# EAGLE schematic IBL behavior control (EAGLE 6.5.0)
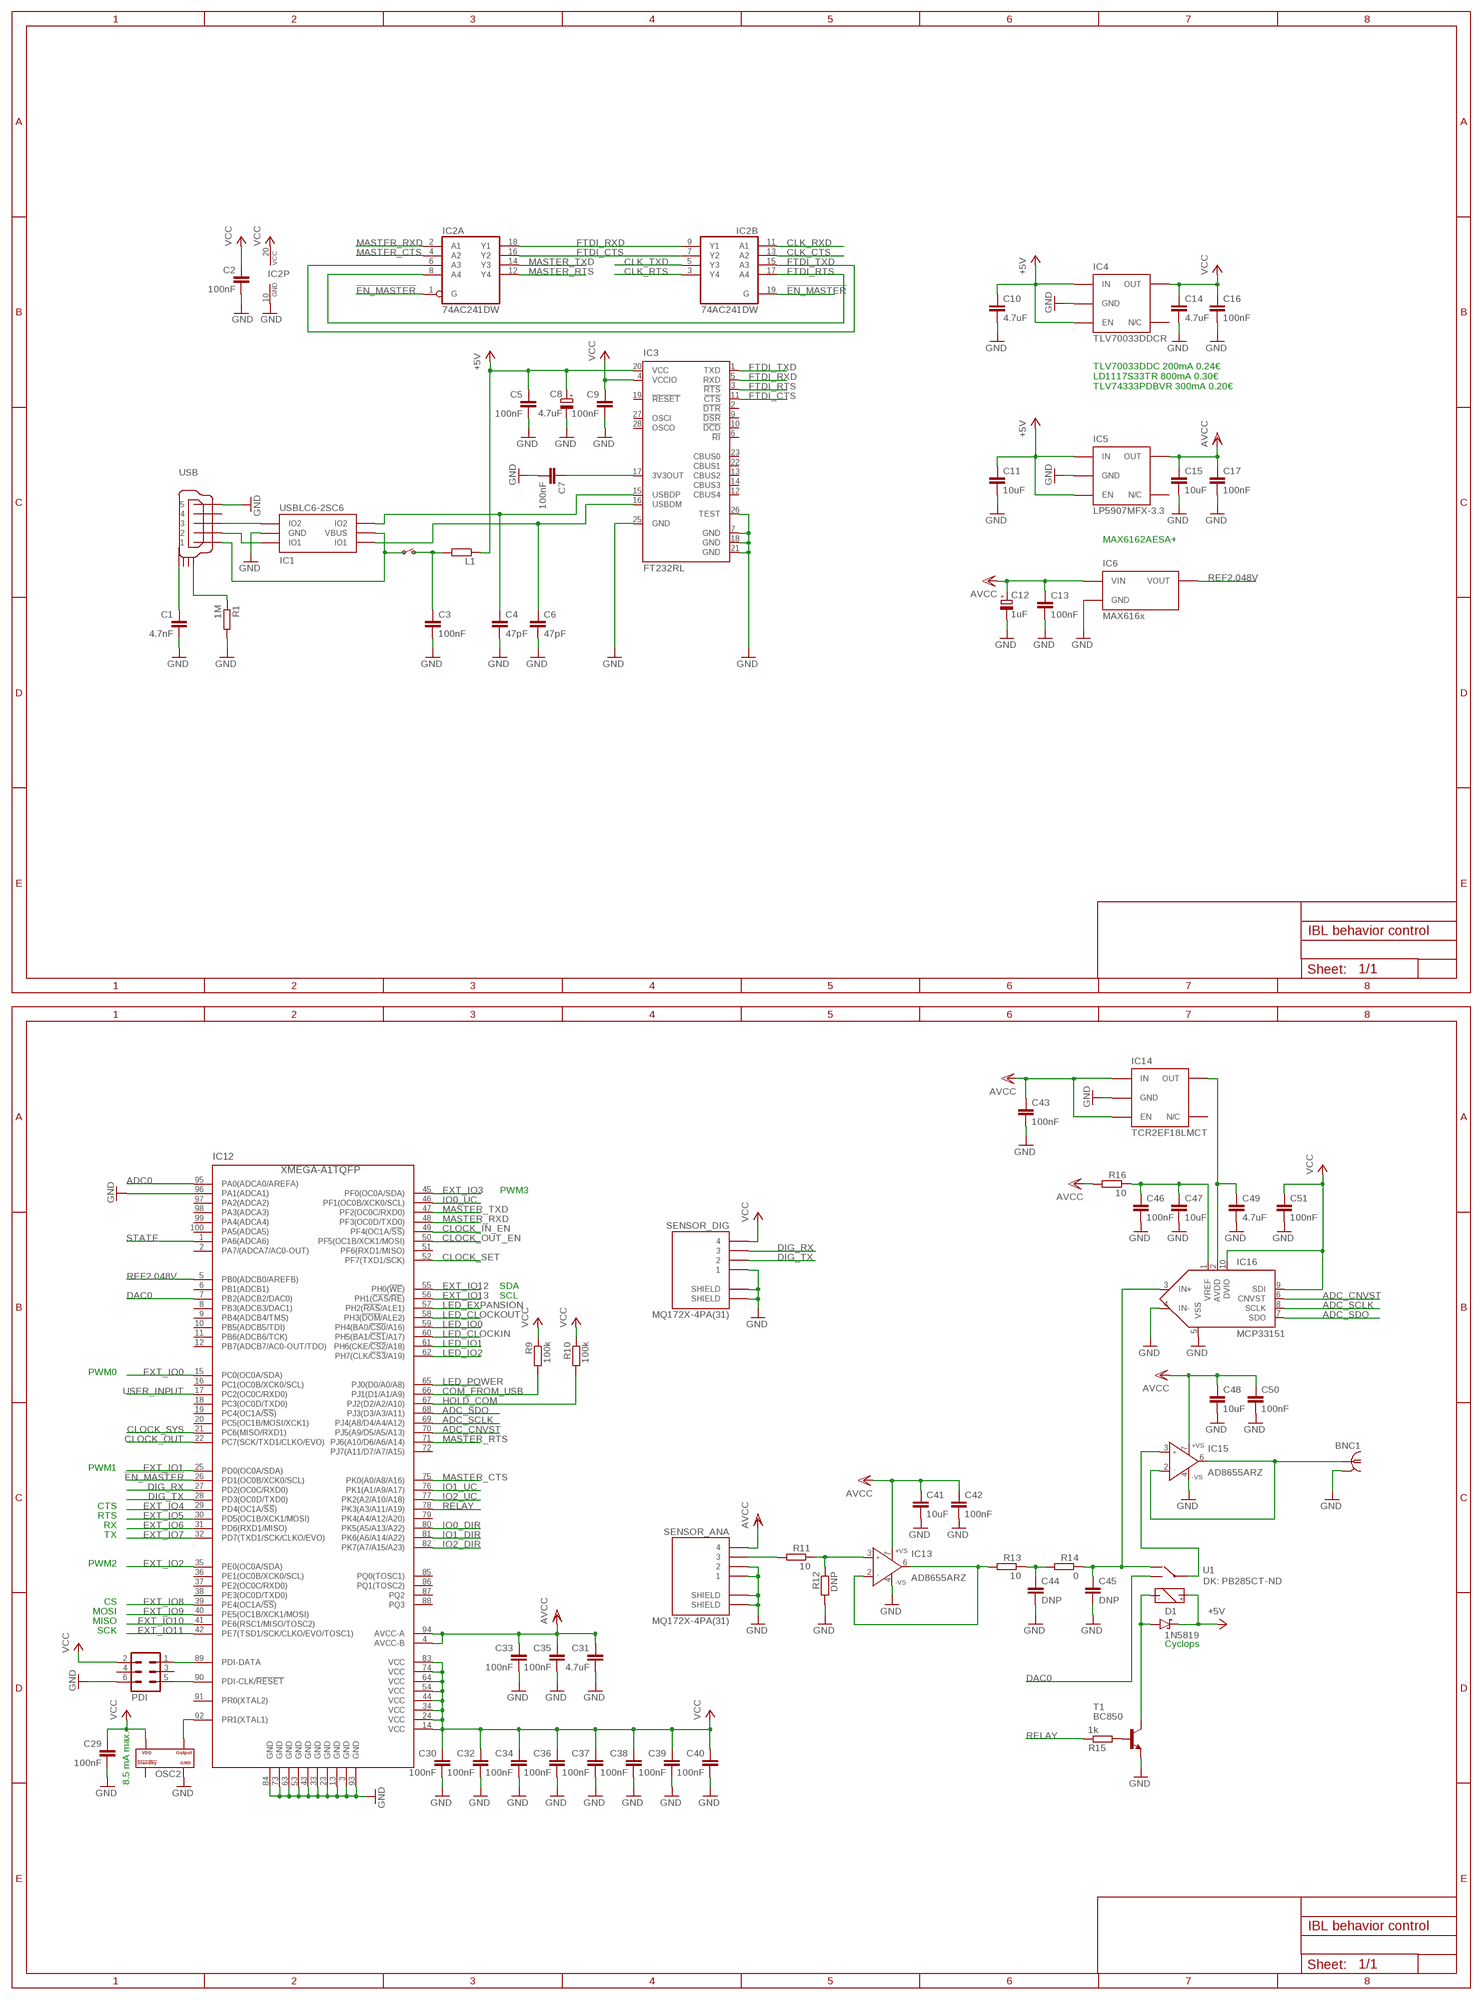
[diagram p0: schematic, sheet 1, part 1 of 2]
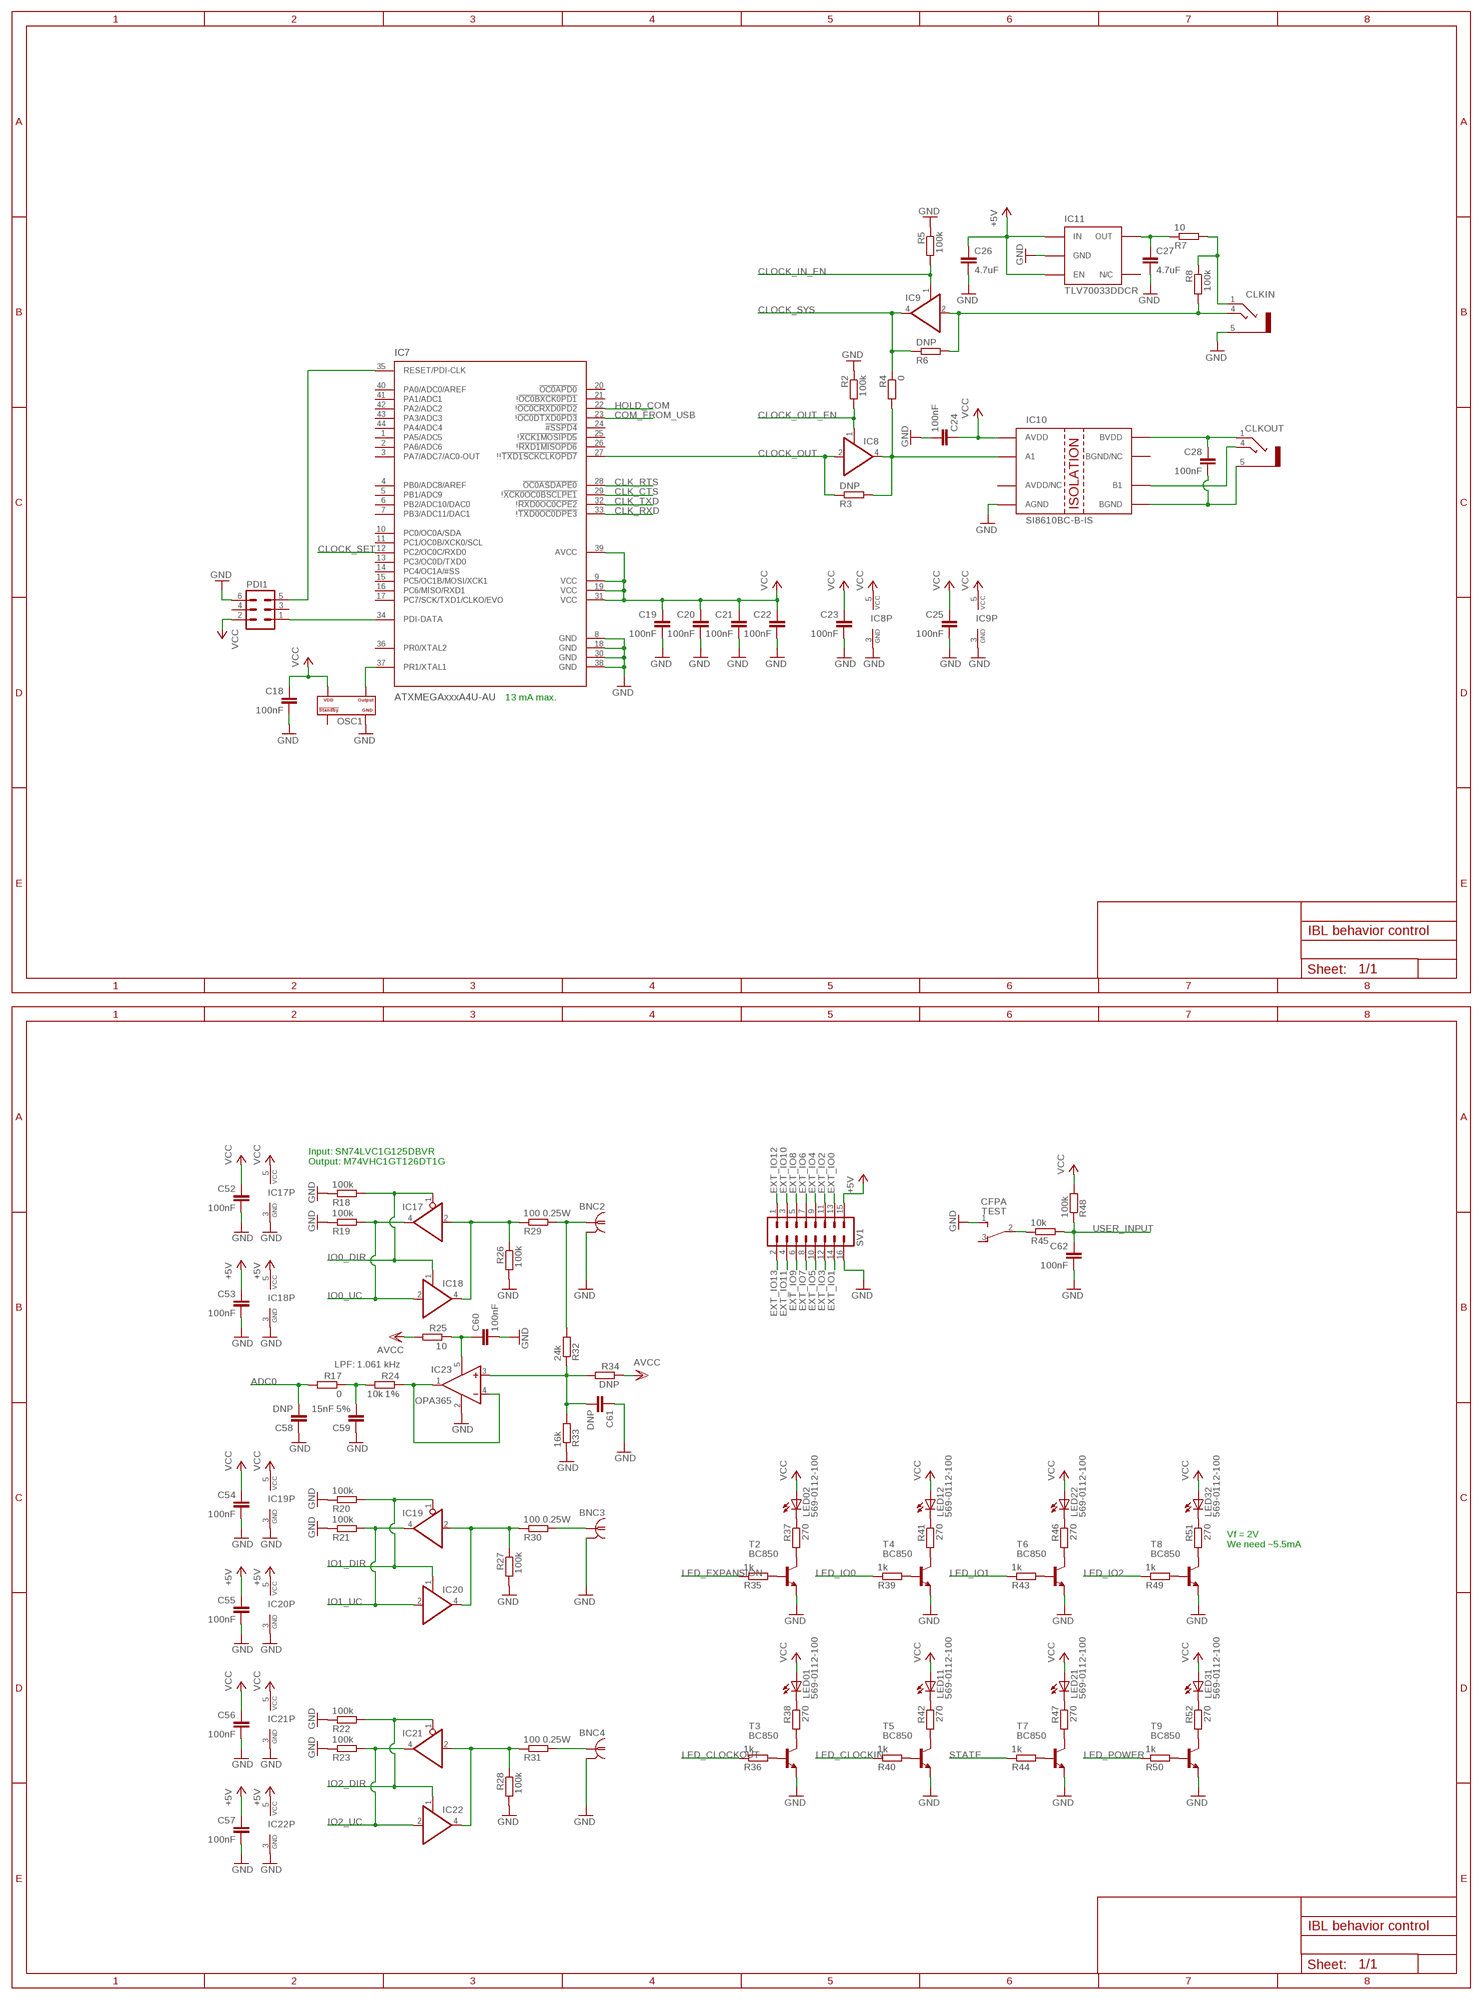
[diagram p1: schematic, sheet 1, part 2 of 2]

## Parts
BNC1  BNC_0731000105  [0731000105]
BNC2  BNC_0731000105  [0731000105]
BNC3  BNC_0731000105  [0731000105]
BNC4  BNC_0731000105  [0731000105]
C1  4.7nF  C-EUC0402  [C0402]
C2  100nF  C-EUC0402  [C0402]
C3  100nF  C-EUC0402  [C0402]
C4  47pF  C-EUC0402  [C0402]
C5  100nF  C-EUC0402  [C0402]
C6  47pF  C-EUC0402  [C0402]
C7  100nF  C-EUC0402  [C0402]
C8  4.7uF  CPOL-EUA/3216-18W  [A/3216-18W]
C9  100nF  C-EUC0402  [C0402]
C10  4.7uF  C-EUC0603  [C0603]
C11  10uF  C-EUC0603  [C0603]
C12  1uF  CPOL-EUR/2012-12R  [R/2012-12R]
C13  100nF  C-EUC0402  [C0402]
C14  4.7uF  C-EUC0603  [C0603]
C15  10uF  C-EUC0603  [C0603]
C16  100nF  C-EUC0402  [C0402]
C17  100nF  C-EUC0402  [C0402]
C18  100nF  C-EUC0402  [C0402]
C19  100nF  C-EUC0402  [C0402]
C20  100nF  C-EUC0402  [C0402]
C21  100nF  C-EUC0402  [C0402]
C22  100nF  C-EUC0402  [C0402]
C23  100nF  C-EUC0402  [C0402]
C24  100nF  C-EUC0402  [C0402]
C25  100nF  C-EUC0402  [C0402]
C26  4.7uF  C-EUC0603  [C0603]
C27  4.7uF  C-EUC0603  [C0603]
C28  100nF  C-EUC0402  [C0402]
C29  100nF  C-EUC0402  [C0402]
C30  100nF  C-EUC0402  [C0402]
C31  4.7uF  C-EUC0603  [C0603]
C32  100nF  C-EUC0402  [C0402]
C33  100nF  C-EUC0402  [C0402]
C34  100nF  C-EUC0402  [C0402]
C35  100nF  C-EUC0402  [C0402]
C36  100nF  C-EUC0402  [C0402]
C37  100nF  C-EUC0402  [C0402]
C38  100nF  C-EUC0402  [C0402]
C39  100nF  C-EUC0402  [C0402]
C40  100nF  C-EUC0402  [C0402]
C41  10uF  C-EUC0603  [C0603]
C42  100nF  C-EUC0402  [C0402]
C43  100nF  C-EUC0402  [C0402]
C44  DNP  C-EUC0402  [C0402]
C45  DNP  C-EUC0402  [C0402]
C46  100nF  C-EUC0402  [C0402]
C47  10uF  C-EUC0603  [C0603]
C48  10uF  C-EUC0603  [C0603]
C49  4.7uF  C-EUC0603  [C0603]
C50  100nF  C-EUC0402  [C0402]
C51  100nF  C-EUC0402  [C0402]
C52  100nF  C-EUC0402  [C0402]
C53  100nF  C-EUC0402  [C0402]
C54  100nF  C-EUC0402  [C0402]
C55  100nF  C-EUC0402  [C0402]
C56  100nF  C-EUC0402  [C0402]
C57  100nF  C-EUC0402  [C0402]
C58  DNP  C-EUC0402  [C0402]
C59  15nF 5%  C-EUC0402  [C0402]
C60  100nF  C-EUC0402  [C0402]
C61  DNP  C-EUC0402  [C0402]
C62  100nF  C-EUC0402  [C0402]
CLKIN  STEREO_JACK  [35RASMT2BHNTRX]
CLKOUT  STEREO_JACK  [35RASMT2BHNTRX]
D1  1N5819  S-DIODESOD-123  [SOD123]
IC1  USBLC6-2SC6  USBLC6-2  [SOT23-6L]
IC2  74AC241DW  [SO20W]
IC3  FT232RL  [SSOP28]
IC4  TLV70033DDCR  TLV700XX  [TSOT23-5]
IC5  LP5907MFX-3.3  TLV700XX  [TSOT23-5]
IC6  MAX616x  ADR45XX  [SO-08]
IC7  ATXMEGAxxxA4U-AU  AT-XMEGA-XXA4-AU  [QFP80P1200X1200X120-44N]
IC8  74AHC1G126DCK  [SC70-5]
IC9  74AHC1G126DCK  [SC70-5]
IC10  SI8610BC-B-IS  SI8610  [SO-08]
IC11  TLV70033DDCR  TLV700XX  [TSOT23-5]
IC12  XMEGA-A1TQFP  [TQFP100]
IC13  AD8655ARZ  AD8655R  [SO8]
IC14  TCR2EF18LMCT  TLV700XX  [TSOT23-5]
IC15  AD8655ARZ  AD8655R  [SO8]
IC16  MCP33151  [MSOP10]
IC17  74AHC1G125DBV  [SOT23-5]
IC18  74AHC1G126DCK  [SC70-5]
IC19  74AHC1G125DBV  [SOT23-5]
IC20  74AHC1G126DCK  [SC70-5]
IC21  74AHC1G125DBV  [SOT23-5]
IC22  74AHC1G126DCK  [SC70-5]
IC23  OPA365  [SOT23-5]
L1  ???  R-EU_R0805  [R0805]
LED0  569-0112-100  LED_2X_VERTICAL  [569-011X-X00_LED_ARRAY]
LED1  569-0112-100  LED_2X_VERTICAL  [569-011X-X00_LED_ARRAY]
LED2  569-0112-100  LED_2X_VERTICAL  [569-011X-X00_LED_ARRAY]
LED3  569-0112-100  LED_2X_VERTICAL  [569-011X-X00_LED_ARRAY]
OSC1  OSCILLATOR  [OSCILLATOR_3.2X2.5]
OSC2  OSCILLATOR  [OSCILLATOR_3.2X2.5]
PDI  MA03-2  [MA03-2]
PDI1  MA03-2  [MA03-2]
R1  1M  R-EU_R0402  [R0402]
R2  100k  R-EU_R0402  [R0402]
R3  DNP  R-EU_R0402  [R0402]
R4  0  R-EU_R0402  [R0402]
R5  100k  R-EU_R0402  [R0402]
R6  DNP  R-EU_R0402  [R0402]
R7  10  R-EU_R0402  [R0402]
R8  100k  R-EU_R0402  [R0402]
R9  100k  R-EU_R0402  [R0402]
R10  100k  R-EU_R0402  [R0402]
R11  10  R-EU_R0402  [R0402]
R12  DNP  R-EU_R0402  [R0402]
R13  10  R-EU_R0402  [R0402]
R14  0  R-EU_R0402  [R0402]
R15  1k  R-EU_R0402  [R0402]
R16  10  R-EU_R0402  [R0402]
R17  0  R-EU_R0402  [R0402]
R18  100k  R-EU_R0402  [R0402]
R19  100k  R-EU_R0402  [R0402]
R20  100k  R-EU_R0402  [R0402]
R21  100k  R-EU_R0402  [R0402]
R22  100k  R-EU_R0402  [R0402]
R23  100k  R-EU_R0402  [R0402]
R24  10k 1%  R-EU_R0402  [R0402]
R25  10  R-EU_R0402  [R0402]
R26  100k  R-EU_R0402  [R0402]
R27  100k  R-EU_R0402  [R0402]
R28  100k  R-EU_R0402  [R0402]
R29  100 0.25W  R-EU_R0603  [R0603]
R30  100 0.25W  R-EU_R0603  [R0603]
R31  100 0.25W  R-EU_R0603  [R0603]
R32  24k  R-EU_R0402  [R0402]
R33  16k  R-EU_R0402  [R0402]
R34  DNP  R-EU_R0402  [R0402]
R35  1k  R-EU_R0402  [R0402]
R36  1k  R-EU_R0402  [R0402]
R37  270  R-EU_R0402  [R0402]
R38  270  R-EU_R0402  [R0402]
R39  1k  R-EU_R0402  [R0402]
R40  1k  R-EU_R0402  [R0402]
R41  270  R-EU_R0402  [R0402]
R42  270  R-EU_R0402  [R0402]
R43  1k  R-EU_R0402  [R0402]
R44  1k  R-EU_R0402  [R0402]
R45  10k  R-EU_R0402  [R0402]
R46  270  R-EU_R0402  [R0402]
R47  270  R-EU_R0402  [R0402]
R48  100k  R-EU_R0402  [R0402]
R49  1k  R-EU_R0402  [R0402]
R50  1k  R-EU_R0402  [R0402]
R51  270  R-EU_R0402  [R0402]
R52  270  R-EU_R0402  [R0402]
SENSOR_ANA  MQ172X-4PA(31)  [MQ172X-4PA(31)]
SENSOR_DIG  MQ172X-4PA(31)  [MQ172X-4PA(31)]
SV1  ML16L  [ML16L]
T1  BC850  [SOT23]
T2  BC850  [SOT23]
T3  BC850  [SOT23]
T4  BC850  [SOT23]
T5  BC850  [SOT23]
T6  BC850  [SOT23]
T7  BC850  [SOT23]
T8  BC850  [SOT23]
T9  BC850  [SOT23]
TEST  CFPA  SPDT_CFPA  [CFPA]
U1  DK: PB285CT-ND  RELAY  [RELAY]
USB  USB_MINI_B  [240-0002-1]

## Nets
5VSWITCH: C3.1 L1.2
5VUSB: IC1.P$5(VBUS) USB.P$1
!EN_MASTER: IC2.1(A:G) IC2.19(B:G) IC12.26(PD1(OC0B/XCK0/SCL))
+5V: C5.1 C8.+ C10.1 C11.1 C26.1 C53.1 C55.1 C57.1 D1.C IC3.20(VCC) IC4.1(IN) IC4.3(EN) IC5.1(IN) IC5.3(EN) IC11.1(IN) IC11.3(EN) IC18.5(VCC) IC20.5(VCC) IC22.5(VCC) L1.1 SV1.15 U1.3(R+)
ADC0: C58.2 IC12.95(PA0(ADCA0/AREFA)) R17.2
ADC_CNVST: IC12.70(PJ5(A9/D5/A5/A13)) IC16.6(CNVST)
ADC_SCLK: IC12.69(PJ4(A8/D4/A4/A12)) IC16.8(SCLK)
ADC_SDO: IC12.68(PJ3(D3/A3/A11)) IC16.7(SDO)
CLK_CTS: IC2.13(B:A2) IC7.29(!!XCK0OC0BSCLPE1)
CLK_RTS: IC2.3(B:Y4) IC7.28(!OC0ASDAPE0)
CLK_RXD: IC2.11(B:A1) IC7.33(!!TXD0OC0DPE3)
CLK_TXD: IC2.5(B:Y3) IC7.32(!!RXD0OC0CPE2)
CLOCK_IN_EN: IC9.1(OE) IC12.49(PF4(OC1A/!SS!)) R5.2
CLOCK_OUT: IC7.27(!!!TXD1SCKCLKOPD7) IC8.2(I) IC12.22(PC7(SCK/TXD1/CLKO/EVO)) R3.1
CLOCK_OUT_EN: IC8.1(OE) IC12.50(PF5(OC1B/XCK1/MOSI)) R2.2
CLOCK_SET: IC7.12(PC2/OC0C/RXD0) IC12.52(PF7(TXD1/SCK))
CLOCK_SYS: IC9.4(O) IC12.21(PC6(MISO/RXD1)) R4.1 R6.1
COM_FROM_USB: IC7.23(!!OC0DTXD0PD3) IC12.66(PJ1(D1/A1/A9)) R9.2
DAC0: IC12.7(PB2(ADCB2/DAC0)) U1.10(NO)
DIG_RX: IC12.27(PD2(OC0C/RXD0)) SENSOR_DIG.3
DIG_TX: IC12.28(PD3(OC0D/TXD0)) SENSOR_DIG.2
EXT_IO0: IC12.15(PC0(OC0A/SDA)) SV1.13
EXT_IO1: IC12.25(PD0(OC0A/SDA)) SV1.14
EXT_IO2: IC12.35(PE0(OC0A/SDA)) SV1.11
EXT_IO3: IC12.45(PF0(OC0A/SDA)) SV1.12
EXT_IO4: IC12.29(PD4(OC1A/!SS!)) SV1.9
EXT_IO5: IC12.30(PD5(OC1B/XCK1/MOSI)) SV1.10
EXT_IO6: IC12.31(PD6(RXD1/MISO)) SV1.7
EXT_IO7: IC12.32(PD7(TXD1/SCK/CLKO/EVO)) SV1.8
EXT_IO8: IC12.39(PE4(OC1A/!SS!)) SV1.5
EXT_IO9: IC12.40(PE5(OC1B/XCK1/MOSI)) SV1.6
EXT_IO10: IC12.41(PE6(RSC1/MISO/TOSC2)) SV1.3
EXT_IO11: IC12.42(PE7(TSD1/SCK/CLKO/EVO/TOSC1)) SV1.4
EXT_IO12: IC12.55(PH0(!WE!)) SV1.1
EXT_IO13: IC12.56(PH1(!CAS!/!RE!)) SV1.2
FTDI_CTS: IC2.7(B:Y2) IC2.16(A:Y2) IC3.11(!CTS)
FTDI_RTS: IC2.8(A:A4) IC2.17(B:A4) IC3.3(!RTS)
FTDI_RXD: IC2.9(B:Y1) IC2.18(A:Y1) IC3.5(RXD)
FTDI_TXD: IC2.6(A:A3) IC2.15(B:A3) IC3.1(TXD)
GND: BNC1.2 BNC1.3 BNC2.2 BNC2.3 BNC3.2 BNC3.3 BNC4.2 BNC4.3 C1.2 C2.2 C3.2 C4.2 C5.2 C6.2 C7.2 C8.- C9.2 C10.2 C11.2 C12.- C13.2 C14.2 C15.2 C16.2 C17.2 C18.2 C19.2 C20.2 C21.2 C22.2 C23.2 C24.2 C25.2 C26.2 C27.2 C29.2 C30.2 C31.2 C32.2 C33.2 C34.2 C35.2 C36.2 C37.2 C38.2 C39.2 C40.2 C41.2 C42.2 C43.2 C44.2 C45.2 C46.2 C47.2 C48.2 C49.2 C50.2 C51.2 C52.2 C53.2 C54.2 C55.2 C56.2 C57.2 C58.1 C59.1 C60.2 C61.1 C62.2 CLKIN.5 IC1.P$2(GND) IC2.10(P:GND) IC3.7(GND) IC3.18(GND) IC3.21(GND) IC3.25(GND) IC3.26(TEST) IC4.2(GND) IC5.2(GND) IC6.4(GND) IC7.8(GND) IC7.18(GND) IC7.30(GND) IC7.38(GND) IC8.3(GND) IC9.3(GND) IC10.4(AGND) IC11.2(GND) IC12.3(GND) IC12.13(GND) IC12.23(GND) IC12.33(GND) IC12.43(GND) IC12.53(GND) IC12.63(GND) IC12.73(GND) IC12.84(GND) IC12.93(GND) IC12.96(PA1(ADCA1)) IC13.4(-VS) IC14.2(GND) IC15.4(-VS) IC16.4(IN-) IC16.5(VSS) IC17.3(GND) IC18.3(GND) IC19.3(GND) IC20.3(GND) IC21.3(GND) IC22.3(GND) IC23.2(V-) OSC1.P$2(GND) OSC2.P$2(GND) PDI1.6 PDI.6 R1.2 R2.1 R5.1 R12.2 R18.1 R19.1 R20.1 R21.1 R22.1 R23.1 R26.2 R27.2 R28.2 R33.1 SENSOR_ANA.1 SENSOR_ANA.2 SENSOR_ANA.SHIELD1(SHIELD) SENSOR_ANA.SHIELD2(SHIELD) SENSOR_DIG.1 SENSOR_DIG.SHIELD1(SHIELD) SENSOR_DIG.SHIELD2(SHIELD) SV1.16 T1.2(E) T2.2(E) T3.2(E) T4.2(E) T5.2(E) T6.2(E) T7.2(E) T8.2(E) T9.2(E) TEST.1 USB.P$5
GND_ISO: C28.2 CLKOUT.5 IC10.5(BGND)
HOLD_COM: IC7.22(!!OC0CRXD0PD2) IC12.67(PJ2(D2/A2/A10)) R10.2
IO0_ANALOG: C59.2 R17.1 R24.2
IO0_DIR: IC12.80(PK5(A5/A13/A22)) IC17.1(OE) IC18.1(OE) R18.2
IO0_UC: IC12.46(PF1(OC0B/XCK0/SCL)) IC17.4(O) IC18.2(I) R19.2
IO1_DIR: IC12.81(PK6(A6/A14/A22)) IC19.1(OE) IC20.1(OE) R20.2
IO1_UC: IC12.76(PK1(A1/A9/A17)) IC19.4(O) IC20.2(I) R21.2
IO2_DIR: IC12.82(PK7(A7/A15/A23)) IC21.1(OE) IC22.1(OE) R22.2
IO2_UC: IC12.77(PK2(A2/A10/A18)) IC21.4(O) IC22.2(I) R23.2
LED_CLOCKIN: IC12.60(PH5(BA1/!CS1!/A17)) R40.1
LED_CLOCKOUT: IC12.58(PH3(!DOM!/ALE2)) R36.1
LED_EXPANSION: IC12.57(PH2(!RAS!/ALE1)) R35.1
LED_IO0: IC12.59(PH4(BA0/!CS0!/A16)) R39.1
LED_IO1: IC12.61(PH6(CKE/!CS2!/A18)) R43.1
LED_IO2: IC12.62(PH7(CLK/!CS3!/A19)) R49.1
LED_POWER: IC12.65(PJ0(D0/A0/A8)) R50.1
MASTER_CTS: IC2.4(A:A2) IC12.75(PK0(A0/A8/A16))
MASTER_RTS: IC2.12(A:Y4) IC12.71(PJ6(A10/D6/A6/A14))
MASTER_RXD: IC2.2(A:A1) IC12.48(PF3(OC0D/TXD0))
MASTER_TXD: IC2.14(A:Y3) IC12.47(PF2(OC0C/RXD0))
N$2: CLKOUT.4 IC10.6(B1)
N$3: R35.2 T2.1(B)
N$4: LED0.C2(2:C) R37.1
N$5: C28.1 CLKOUT.1 IC10.8(BVDD)
N$6: IC17.2(I) IC18.4(O) R26.1 R29.1
N$8: R37.2 T2.3(C)
N$9: BNC2.1 R29.2 R32.2
N$10: IC19.2(I) IC20.4(O) R27.1 R30.1
N$11: BNC3.1 R30.2
N$12: IC21.2(I) IC22.4(O) R28.1 R31.1
N$13: BNC4.1 R31.2
N$14: R36.2 T3.1(B)
N$15: R43.2 T6.1(B)
N$16: R38.2 T3.3(C)
N$17: R39.2 T4.1(B)
N$18: LED3.C1(1:C) R52.1
N$19: R41.2 T4.3(C)
N$20: R40.2 T5.1(B)
N$21: R46.2 T6.3(C)
N$22: R42.2 T5.3(C)
N$23: LED3.C2(2:C) R51.1
N$24: R44.2 T7.1(B)
N$25: R47.2 T7.3(C)
N$26: R49.2 T8.1(B)
N$27: R51.2 T8.3(C)
N$28: R50.2 T9.1(B)
N$29: R52.2 T9.3(C)
N$30: LED1.C2(2:C) R41.1
N$31: LED2.C2(2:C) R46.1
N$32: LED1.C1(1:C) R42.1
N$33: LED2.C1(1:C) R47.1
N$34: R45.1 TEST.2
N$35: C60.1 IC23.5(V+) R25.1
N$36: LED0.C1(1:C) R38.1
N$37: IC13.2(IN-) IC13.6(OUT) R13.2
N$38: C7.1 IC3.17(3V3OUT)
N$39: IC13.3(IN+) R11.1 R12.1
N$40: IC1.P$1(IO1) USB.P$2
N$41: CLKIN.1 R7.2 R8.1
N$42: C27.1 IC11.5(OUT) R7.1
N$43: IC8.4(O) IC10.2(A1) R3.2 R4.2
N$44: C49.1 IC14.5(OUT) IC16.2(AVDD)
N$45: C44.1 R13.1 R14.2
N$46: C45.1 IC16.3(IN+) R14.1 U1.1(NC)
N$48: BNC1.1 IC15.2(IN-) IC15.6(OUT)
N$49: C46.1 C47.1 IC16.1(VREF) R16.1
N$50: IC1.P$3(IO2) USB.P$3
N$51: IC15.3(IN+) U1.5(IN)
N$52: R11.2 SENSOR_ANA.3
N$55: R15.2 T1.1(B)
N$57: D1.A T1.3(C) U1.8(R-)
N$58: IC23.1(OUT) IC23.4(-IN) R24.1
N$59: C1.1 USB.SHIELD_4
N$61: R1.1 USB.SHIELD_1
N$64: C61.2 IC23.3(+IN) R32.1 R33.2 R34.2
OSC1: IC12.92(PR1(XTAL1)) OSC2.P$3(OUTPUT)
OSC2: IC7.37(PR1/XTAL1) OSC1.P$3(OUTPUT)
PDI-CLK: IC7.35(RESET/PDI-CLK) PDI1.5
PDI-DATA: IC7.34(PDI-DATA) PDI1.1
PDI_CLK: IC12.90(PDI-CLK/!RESET) PDI.5
PDI_DATA: IC12.89(PDI-DATA) PDI.1
REF2.048V: IC6.6(VOUT) IC12.5(PB0(ADCB0/AREFB))
RELAY: IC12.78(PK3(A3/A11/A19)) R15.1
STATE: IC12.1(PA6(ADCA6)) R44.1
SYNCIN: CLKIN.4 IC9.2(I) R6.2 R8.2
USBDM: C6.1 IC1.P$6(IO1) IC3.16(USBDM)
USBDP: C4.1 IC1.P$4(IO2) IC3.15(USBDP)
USER_INPUT: C62.1 IC12.17(PC2(OC0C/RXD0)) R45.2 R48.1
VCC: C2.1 C9.1 C14.1 C16.1 C18.1 C19.1 C20.1 C21.1 C22.1 C23.1 C24.1 C25.1 C29.1 C30.1 C32.1 C34.1 C36.1 C37.1 C38.1 C39.1 C40.1 C51.1 C52.1 C54.1 C56.1 IC2.20(P:VCC) IC3.4(VCCIO) IC4.5(OUT) IC7.9(VCC) IC7.19(VCC) IC7.31(VCC) IC7.39(AVCC) IC8.5(VCC) IC9.5(VCC) IC10.1(AVDD) IC12.14(VCC) IC12.24(VCC) IC12.34(VCC) IC12.44(VCC) IC12.54(VCC) IC12.64(VCC) IC12.74(VCC) IC12.83(VCC) IC16.9(SDI) IC16.10(DVIO) IC17.5(VCC) IC19.5(VCC) IC21.5(VCC) LED0.A1(1:A) LED0.A2(2:A) LED1.A1(1:A) LED1.A2(2:A) LED2.A1(1:A) LED2.A2(2:A) LED3.A1(1:A) LED3.A2(2:A) OSC1.P$4(VDD) OSC2.P$4(VDD) PDI1.2 PDI.2 R9.1 R10.1 R48.2 SENSOR_DIG.4
VDD: C12.+ C13.1 C15.1 C17.1 C31.1 C33.1 C35.1 C41.1 C42.1 C43.1 C48.1 C50.1 IC5.5(OUT) IC6.2(VIN) IC12.4(AVCC-B) IC12.94(AVCC-A) IC13.7(+VS) IC14.1(IN) IC14.3(EN) IC15.7(+VS) R16.2 R25.2 R34.1 SENSOR_ANA.4 ; supply symbol labelled AVCC
Unconnected: IC3.2(!DTR) IC3.6(!RI) IC3.9(!DSR) IC3.10(!DCD) IC3.12(CBUS4) IC3.13(CBUS2) IC3.14(CBUS3) IC3.19(!RESET) IC3.22(CBUS1) IC3.23(CBUS0) IC3.27(OSCI) IC3.28(OSCO) IC4.4(N/C) IC5.4(N/C) IC7.1(PA5/ADC5) IC7.2(PA6/ADC6) IC7.3(PA7/ADC7/AC0-OUT) IC7.4(PB0/ADC8/AREF) IC7.5(PB1/ADC9) IC7.6(PB2/ADC10/DAC0) IC7.7(PB3/ADC11/DAC1) IC7.10(PC0/OC0A/SDA) IC7.11(PC1/OC0B/XCK0/SCL) IC7.13(PC3/OC0D/TXD0) IC7.14(PC4/OC1A/#SS) IC7.15(PC5/OC1B/MOSI/XCK1) IC7.16(PC6/MISO/RXD1) IC7.17(PC7/SCK/TXD1/CLKO/EVO) IC7.20(!OC0APD0) IC7.21(!!OC0BXCK0PD1) IC7.24(!#SSPD4) IC7.25(!!XCK1MOSIPD5) IC7.26(!!RXD1MISOPD6) IC7.36(PR0/XTAL2) IC7.40(PA0/ADC0/AREF) IC7.41(PA1/ADC1) IC7.42(PA2/ADC2) IC7.43(PA3/ADC3) IC7.44(PA4/ADC4) IC10.3(AVDD/NC) IC10.7(BGND/NC) IC11.4(N/C) IC12.2(PA7/(ADCA7/AC0-OUT)) IC12.6(PB1(ADCB1)) IC12.8(PB3(ADCB3/DAC1)) IC12.9(PB4(ADCB4/TMS)) IC12.10(PB5(ADCB5/TDI)) IC12.11(PB6(ADCB6/TCK)) IC12.12(PB7(ADCB7/AC0-OUT/TDO)) IC12.16(PC1(OC0B/XCK0/SCL)) IC12.18(PC3(OC0D/TXD0)) IC12.19(PC4(OC1A/!SS!)) IC12.20(PC5(OC1B/MOSI/XCK1)) IC12.36(PE1(OC0B/XCK0/SCL)) IC12.37(PE2(OC0C/RXD0)) IC12.38(PE3(OC0D/TXD0)) IC12.51(PF6(RXD1/MISO)) IC12.72(PJ7(A11/D7/A7/A15)) IC12.79(PK4(A4/A12/A20)) IC12.85(PQ0(TOSC1)) IC12.86(PQ1(TOSC2)) IC12.87(PQ2) IC12.88(PQ3) IC12.91(PR0(XTAL2)) IC12.97(PA2(ADCA2)) IC12.98(PA3(ADCA3)) IC12.99(PA4(ADCA4)) IC12.100(PA5(ADCA5)) IC14.4(N/C) OSC1.P$1(STANDBY#) OSC2.P$1(STANDBY#) PDI1.3 PDI1.4 PDI.3 PDI.4 TEST.3 USB.P$4 USB.SHIELD_2 USB.SHIELD_3

## Notes on the sheet
- TLV70033DDC 200mA 0.24€
  LD1117S33TR 800mA 0.30€
  TLV74333PDBVR 300mA 0.20€
- MAX6162AESA+
- 13 mA max.
- Input: SN74LVC1G125DBVR
  Output: M74VHC1GT126DT1G
- PWM3
- SDA
- SCL
- LPF: 1.061 kHz
- PWM0
- PWM1
- CTS
- RTS
- RX
- TX
- Vf = 2V
  We need ~5.5mA
- PWM2
- CS
- MOSI
- MISO
- SCK
- Cyclops
- 8.5 mA max.

## Library data of the parts
BNC1-BNC4 = jonnew:BNC: BNC CONNECTOR M/A COM www.macom.com distributor Farnell 149-452
C1-C7 C9-C11 C13-C62 = rcl:C-EU: CAPACITOR, European symbol
C8 C12 = rcl:CPOL-EU: POLARIZED CAPACITOR, European symbol
CLKIN CLKOUT = CNP-connectors:STEREO_JACK
D1 = jonnew:S-DIODE: Schottky Diode
IC1 = CNP 2:USBLC6-2
IC2 = 74xx-eu:74*241: Octal BUFFER and LINE DRIVER, 3-state
IC3 = ftdichip:FT232R: Source: http://www.ftdichip.com/Documents/DataSheets/DS_FT232R_v104.pdf; MPN: FT232RL; OC_FARNELL: 1146032; OC_NEWARK: 91K9918
IC4 IC5 IC11 IC14 = CNP:TLV700XX
IC6 = CNP-ics 2:ADR45XX
IC7 = xmega-a4:AT-XMEGA-XXA4-AU: ATxMega a4 Serie
IC8 IC9 IC18 IC20 IC22 = 74xx-little-de:74*1G126: Single Bus Buffer Gate With 3-State Outputs
IC10 = CNP-ics 2:SI8610
IC12 = avr-7:XMEGA-A1: Atmel XMega A1 Series processor
IC13 IC15 = analog-devices:AD8655: Low Noise, Precision CMOS Amplifier Source: http://www.analog.com/static/imported-files/data_sheets/AD8655_8656.pdf; MF: ALTERA CORPORATION; MPN: AD8655ARMZ-REEL; OC_FARNELL: 1078267; OC_NEWARK: 59K7050
IC16 = MCP33151:MCP33151
IC17 IC19 IC21 = 74xx-little-de:74*1G125: Single Bus Buffer Gate with 3-State Output
IC23 = CNP-ics 2:OPA365
L1 R1-R52 = rcl:R-EU_: RESISTOR, European symbol
LED0 LED1-LED3 = jonnew:LED_2X
OSC1 OSC2 = CNP-miscellaneous:OSCILLATOR
PDI PDI1 = con-lstb:MA03-2: PIN HEADER; OC_FARNELL: unknown; OC_NEWARK: unknown
SENSOR_ANA SENSOR_DIG = MQ172X-4PA(31):MQ172X-4PA(31)
SV1 = con-ml:ML16L: HARTING; OC_FARNELL: unknown; OC_NEWARK: unknown
T1-T9 = transistor:BC850: NPN TRANSISTOR
TEST = cyclops:SPDT: SPDT Switch
U1 = relay:RELAY
USB = CNP-connectors:USB_MINI_B